# Altium schematic sheet OZ440-SE130-CAR001-SCH1.SchDoc: Carte IHM
size A3; Date: 08/07/14; CheckedBy: GS; Author: BM; DocumentNumber: OZ440-SE130-CAR001-SCH01; Revision: 2; SheetNumber: 1; SheetTotal: 1
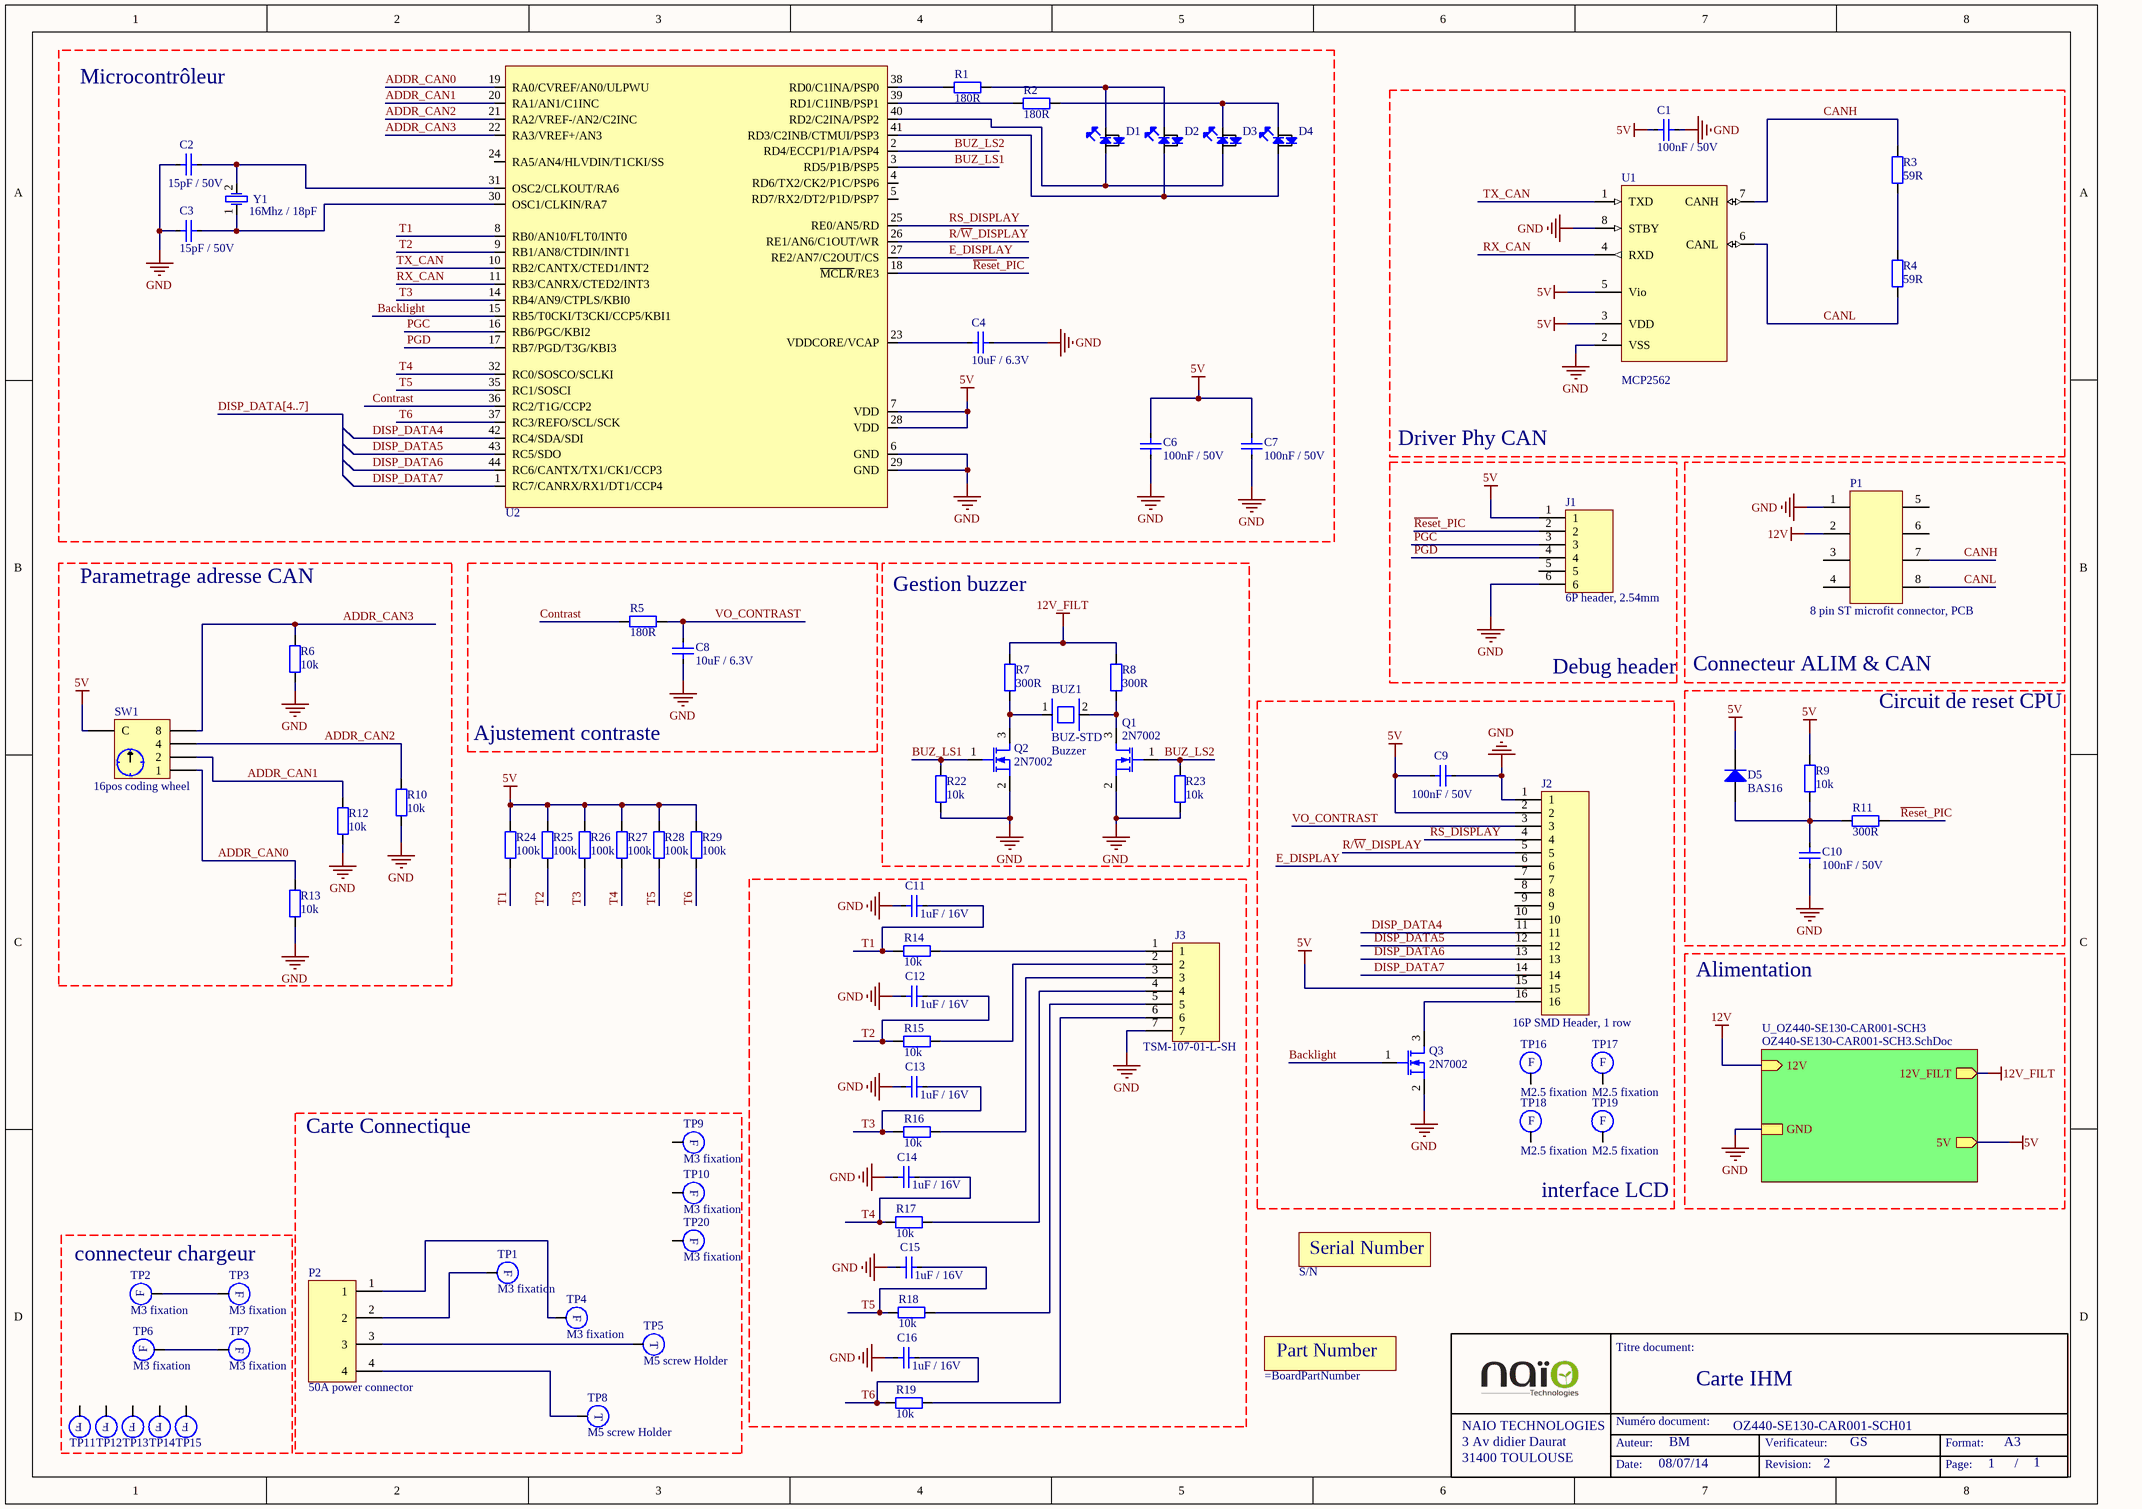
[diagram p0: OZ440-SE130-CAR001-SCH1.SchDoc]

## Parts
BUZ1  BUZ-STD  Displayed reference: Buzzer  [BUZ-SPE-SMAT24_P10]
C1  Displayed reference: 100nF / 50V  [C0805-STD]  (hidden comment: CAP-SMD)
C2  Displayed reference: 15pF / 50V  [C0805-STD]  (hidden comment: CAP-SMD)
C3  Displayed reference: 15pF / 50V  [C0805-STD]  (hidden comment: CAP-SMD)
C4  Displayed reference: 10uF / 6.3V  [C0805-STD]  (hidden comment: CAP-SMD)
C6  Displayed reference: 100nF / 50V  [C0805-STD]  (hidden comment: CAP-SMD)
C7  Displayed reference: 100nF / 50V  [C0805-STD]  (hidden comment: CAP-SMD)
C8  Displayed reference: 10uF / 6.3V  [C0805-STD]  (hidden comment: CAP-SMD)
C9  Displayed reference: 100nF / 50V  [C0805-STD]  (hidden comment: CAP-SMD)
C10  Displayed reference: 100nF / 50V  [C0805-STD]  (hidden comment: CAP-SMD)
C11  Displayed reference: 1uF / 16V  [C0805-STD]  (hidden comment: CAP-SMD)
C12  Displayed reference: 1uF / 16V  [C0805-STD]  (hidden comment: CAP-SMD)
C13  Displayed reference: 1uF / 16V  [C0805-STD]  (hidden comment: CAP-SMD)
C14  Displayed reference: 1uF / 16V  [C0805-STD]  (hidden comment: CAP-SMD)
C15  Displayed reference: 1uF / 16V  [C0805-STD]  (hidden comment: CAP-SMD)
C16  Displayed reference: 1uF / 16V  [C0805-STD]  (hidden comment: CAP-SMD)
D1  LED_BIC  [LED_3MM]  (value not drawn)  (no BOM)
D2  LED_BIC  [LED_3MM]  (value not drawn)  (no BOM)
D3  LED_BIC  [LED_3MM]  (value not drawn)  (no BOM)
D4  LED_BIC  [LED_3MM]  (value not drawn)  (no BOM)
D5  Displayed reference: BAS16  [SOT23-STD]  (hidden comment: BAS16-SOT23)
J1  Displayed reference: 6P header, 2.54mm  [6P_HEADER-STD_TH_1ROW]  (hidden comment: CONN-STD-6P_1ROW)
J2  Displayed reference: 16P SMD Header, 1 row  [16P_HEADER-SPE-TSM_116_01_L_SV]  (hidden comment: CONN-STD-16P_1ROW)
J3  Displayed reference: TSM-107-01-L-SH  [7P_HEADER-SPE-TSM_107_01_L_SH]  (hidden comment: CONN-STD-7P_1ROW)
P1  Displayed reference: 8 pin ST microfit connector, PCB  [CONN-SPE_MOLEX_43045-0812]  (hidden comment: CONN-SPE-8P_MOLEX_43045-0801)
P2  Displayed reference: 50A power connector  [CONN-SPE-428194213_MOLEX]  (hidden comment: CONN-STD-4P_puissance)
PN  PART-NUMBER  [PART_NUMBER_SMALL-STD]  (value not drawn)  (no BOM)
Q1  Displayed reference: 2N7002  [SOT23-SPE-2N7002]  (hidden comment: 2N7002-SMD3P)
Q2  Displayed reference: 2N7002  [SOT23-SPE-2N7002]  (hidden comment: 2N7002-SMD3P)
Q3  Displayed reference: 2N7002  [SOT23-SPE-2N7002]  (hidden comment: 2N7002-SMD3P)
R1  Displayed reference: 180R  [R0805-STD]  (hidden comment: RES-SMD)
R2  Displayed reference: 180R  [R0805-STD]  (hidden comment: RES-SMD)
R3  Displayed reference: 59R  [R0805-STD]  (hidden comment: RES-SMD)
R4  Displayed reference: 59R  [R0805-STD]  (hidden comment: RES-SMD)
R5  Displayed reference: 180R  [R0805-STD]  (hidden comment: RES-SMD)
R6  Displayed reference: 10k  [R0805-STD]  (hidden comment: RES-SMD)
R7  Displayed reference: 300R  [R0805-STD]  (hidden comment: RES-SMD)
R8  Displayed reference: 300R  [R0805-STD]  (hidden comment: RES-SMD)
R9  Displayed reference: 10k  [R0805-STD]  (hidden comment: RES-SMD)
R10  Displayed reference: 10k  [R0805-STD]  (hidden comment: RES-SMD)
R11  Displayed reference: 300R  [R0805-STD]  (hidden comment: RES-SMD)
R12  Displayed reference: 10k  [R0805-STD]  (hidden comment: RES-SMD)
R13  Displayed reference: 10k  [R0805-STD]  (hidden comment: RES-SMD)
R14  Displayed reference: 10k  [R0805-STD]  (hidden comment: RES-SMD)
R15  Displayed reference: 10k  [R0805-STD]  (hidden comment: RES-SMD)
R16  Displayed reference: 10k  [R0805-STD]  (hidden comment: RES-SMD)
R17  Displayed reference: 10k  [R0805-STD]  (hidden comment: RES-SMD)
R18  Displayed reference: 10k  [R0805-STD]  (hidden comment: RES-SMD)
R19  Displayed reference: 10k  [R0805-STD]  (hidden comment: RES-SMD)
R22  Displayed reference: 10k  [R0805-STD]  (hidden comment: RES-SMD)
R23  Displayed reference: 10k  [R0805-STD]  (hidden comment: RES-SMD)
R24  Displayed reference: 100k  [R0805-STD]  (hidden comment: RES-SMD)
R25  Displayed reference: 100k  [R0805-STD]  (hidden comment: RES-SMD)
R26  Displayed reference: 100k  [R0805-STD]  (hidden comment: RES-SMD)
R27  Displayed reference: 100k  [R0805-STD]  (hidden comment: RES-SMD)
R28  Displayed reference: 100k  [R0805-STD]  (hidden comment: RES-SMD)
R29  Displayed reference: 100k  [R0805-STD]  (hidden comment: RES-SMD)
SN1  Displayed reference: S/N  [SERIAL_NUMBER-STD]  (hidden comment: SERIAL-NUMBER)  (no BOM)
SW1  Displayed reference: 16pos coding wheel  [SW-SPE-CTS_220-AMA16]  (hidden comment: Switch-STD-coding_wheel)
TP1  Displayed reference: M3 fixation  [MEC-STD-FIX_M3]  (hidden comment: FIX-STD-PCB_FIXATION)
TP2  Displayed reference: M3 fixation  [MEC-STD-FIX_M3]  (hidden comment: FIX-STD-PCB_FIXATION)
TP3  Displayed reference: M3 fixation  [MEC-STD-FIX_M3]  (hidden comment: FIX-STD-PCB_FIXATION)
TP4  Displayed reference: M3 fixation  [MEC-STD-FIX_M3]  (hidden comment: FIX-STD-PCB_FIXATION)
TP5  Displayed reference: M5 screw Holder  [MEC-SPE-WURTHZ_7460408]  (hidden comment: TP-STD-TEST_POINT)
TP6  Displayed reference: M3 fixation  [MEC-STD-FIX_M3]  (hidden comment: FIX-STD-PCB_FIXATION)
TP7  Displayed reference: M3 fixation  [MEC-STD-FIX_M3]  (hidden comment: FIX-STD-PCB_FIXATION)
TP8  Displayed reference: M5 screw Holder  [MEC-SPE-WURTHZ_7460408]  (hidden comment: TP-STD-TEST_POINT)
TP9  Displayed reference: M3 fixation  [MEC-STD-FIX_M3]  (hidden comment: FIX-STD-PCB_FIXATION)
TP10  Displayed reference: M3 fixation  [MEC-STD-FIX_M3]  (hidden comment: FIX-STD-PCB_FIXATION)
TP11  FIX-STD-PCB_FIXATION  [MEC-STD-FIX_M3]  (value not drawn)
TP12  FIX-STD-PCB_FIXATION  [MEC-STD-FIX_M3]  (value not drawn)
TP13  FIX-STD-PCB_FIXATION  [MEC-STD-FIX_M3]  (value not drawn)
TP14  FIX-STD-PCB_FIXATION  [MEC-STD-FIX_M3]  (value not drawn)
TP15  FIX-STD-PCB_FIXATION  [MEC-STD-FIX_M3]  (value not drawn)
TP16  Displayed reference: M2.5 fixation  [MEC-STD-FIX_M2_5]  (hidden comment: FIX-STD-PCB_FIXATION)
TP17  Displayed reference: M2.5 fixation  [MEC-STD-FIX_M2_5]  (hidden comment: FIX-STD-PCB_FIXATION)
TP18  Displayed reference: M2.5 fixation  [MEC-STD-FIX_M2_5]  (hidden comment: FIX-STD-PCB_FIXATION)
TP19  Displayed reference: M2.5 fixation  [MEC-STD-FIX_M2_5]  (hidden comment: FIX-STD-PCB_FIXATION)
TP20  Displayed reference: M3 fixation  [MEC-STD-FIX_M3]  (hidden comment: FIX-STD-PCB_FIXATION)
U1  Displayed reference: MCP2562  [SO8-SPE-MCP2561]  (hidden comment: MCP2562-SOIC08)
U2  P18F45K80-TQFP44  [TQFP44-SPE-PIC18F45k80]  (value not drawn)
Y1  Displayed reference: 16Mhz / 18pF  [XTAL-SPE-HC49_SMD]  (hidden comment: XTAL-SMD)

## Sub-sheets
U_OZ440-SE130-CAR001-SCH3 = OZ440-SE130-CAR001-SCH3.SchDoc: 12V (in), 5V (out), GND, 12V_FILT (out)

## Nets
5V: C1.2 C6.2 C7.2 C9.2 D5.3(K) J1.1 J2.2 J2.15 R9.2 R24.2 R25.2 R26.2 R27.2 R28.2 R29.2 SW1.C U1.3(VDD) U1.5(Vio) U2.7(VDD) U2.28(VDD) ; sheet U_OZ440-SE130-CAR001-SCH3/5V
12V: P1.2 ; sheet U_OZ440-SE130-CAR001-SCH3/12V
12V_FILT: R7.2 R8.2 ; sheet U_OZ440-SE130-CAR001-SCH3/12V_FILT
GND: C1.1 C2.1 C3.1 C4.2 C6.1 C7.1 C8.1 C9.1 C10.1 C11.2 C12.2 C13.2 C14.2 C15.2 C16.2 J1.6 J2.1 J3.7 P1.1 Q1.2(S) Q2.2(S) Q3.2(S) R6.1 R10.1 R12.1 R13.1 R22.2 R23.2 U1.2(VSS) U1.8(STBY) U2.6(GND) U2.29(GND) ; sheet U_OZ440-SE130-CAR001-SCH3/GND
~{Rese}t_PIC: J1.2 R11.2 U2.18(~{MCLR}/RE3)
ADDR_CAN0: R13.2 SW1.1 U2.19(RA0/CVREF/AN0/ULPWU)
ADDR_CAN1: R12.2 SW1.2 U2.20(RA1/AN1/C1INC)
ADDR_CAN2: R10.2 SW1.4 U2.21(RA2/VREF-/AN2/C2INC)
ADDR_CAN3: R6.2 SW1.8 U2.22(RA3/VREF+/AN3)
Backlight: Q3.1(G) U2.15(RB5/T0CKI/T3CKI/CCP5/KBI1)
BUZ_LS1: Q2.1(G) R22.1 U2.3(RD5/P1B/PSP5)
BUZ_LS2: Q1.1(G) R23.1 U2.2(RD4/ECCP1/P1A/PSP4)
CANH: P1.7 R3.2 U1.7(CANH)
CANL: P1.8 R4.1 U1.6(CANL)
Contrast: R5.1 U2.36(RC2/T1G/CCP2)
DISP_DATA4: J2.11 U2.42(RC4/SDA/SDI)
DISP_DATA5: J2.12 U2.43(RC5/SDO)
DISP_DATA6: J2.13 U2.44(RC6/CANTX/TX1/CK1/CCP3)
DISP_DATA7: J2.14 U2.1(RC7/CANRX/RX1/DT1/CCP4)
E_DISPLAY: J2.6 U2.27(RE2/AN7/C2OUT/CS)
PGC: J1.3 U2.16(RB6/PGC/KBI2)
PGD: J1.4 U2.17(RB7/PGD/T3G/KBI3)
R/~{W}_DISPLAY: J2.5 U2.26(RE1/AN6/C1OUT/WR)
RS_DISPLAY: J2.4 U2.25(RE0/AN5/RD)
RX_CAN: U1.4(RXD) U2.11(RB3/CANRX/CTED2/INT3)
T1: C11.1 R14.2 R24.1 U2.8(RB0/AN10/FLT0/INT0)
T2: C12.1 R15.2 R25.1 U2.9(RB1/AN8/CTDIN/INT1)
T3: C13.1 R16.2 R26.1 U2.14(RB4/AN9/CTPLS/KBI0)
T4: C14.1 R17.2 R27.1 U2.32(RC0/SOSCO/SCLKI)
T5: C15.1 R18.2 R28.1 U2.35(RC1/SOSCI)
T6: C16.1 R19.2 R29.1 U2.37(RC3/REFO/SCL/SCK)
TX_CAN: U1.1(TXD) U2.10(RB2/CANTX/CTED1/INT2)
VO_CONTRAST: C8.2 J2.3 R5.2
NetBUZ1_1: BUZ1.1 Q2.3(D) R7.1
NetBUZ1_2: BUZ1.2 Q1.3(D) R8.1
NetC2_2: C2.2 U2.31(OSC2/CLKOUT/RA6) Y1.2(OSC2)
NetC3_2: C3.2 U2.30(OSC1/CLKIN/RA7) Y1.1(OSC1)
NetC4_1: C4.1 U2.23(VDDCORE/VCAP)
NetC10_2: C10.2 D5.1(A) R9.1 R11.1
NetD1_1: D1.1(A) D3.1(A) U2.40(RD2/C2INA/PSP2)
NetD1_2: D1.2 D2.2 R1.2
NetD2_1: D2.1(A) D4.1(A) U2.41(RD3/C2INB/CTMUI/PSP3)
NetD3_2: D3.2 D4.2 R2.2
NetJ2_16: J2.16 Q3.3(D)
NetJ3_1: J3.1 R14.1
NetJ3_2: J3.2 R15.1
NetJ3_3: J3.3 R16.1
NetJ3_4: J3.4 R17.1
NetJ3_5: J3.5 R18.1
NetJ3_6: J3.6 R19.1
NetP2_1: P2.1 TP4.1(T)
NetP2_2: P2.2 TP1.1(T)
NetP2_3: P2.3 TP5.1(T)
NetP2_4: P2.4 TP8.1(T)
NetR1_1: R1.1 U2.38(RD0/C1INA/PSP0)
NetR2_1: R2.1 U2.39(RD1/C1INB/PSP1)
NetR3_1: R3.1 R4.2
NetTP2_1: TP2.1(T) TP3.1(T)
NetTP6_1: TP6.1(T) TP7.1(T)

Not connected (* = marked no-connect by the designer): J1 5; J2 7 8 9 10; P1 3 4(7) 5(9) 6; TP9 1(T); TP10 1(T); TP11 1(T); TP12 1(T); TP13 1(T); TP14 1(T); TP15 1(T); TP16 1(T); TP17 1(T); TP18 1(T); TP19 1(T); TP20 1(T); U2 4(RD6/TX2/CK2/P1C/PSP6) 5(RD7/RX2/DT2/P1D/PSP7) 24(RA5/AN4/HLVDIN/T1CKI/SS)

## Buses and harness runs
bus DISP_DATA[4..7]

## Notes on the sheet
- Microcontrôleur
- Driver Phy CAN
- Parametrage adresse CAN
- Gestion buzzer
- Debug header
- Connecteur ALIM & CAN
- Circuit de reset CPU
- Ajustement contraste
- Alimentation
- Carte Connectique
- connecteur chargeur
- interface LCD
- Titre document:
- NAIO TECHNOLOGIES
- 3 Av didier Daurat
- 31400 TOULOUSE
- Auteur:
- Numéro document:
- Verificateur:
- Format:
- A3
- Date:
- Revision:
- Page:
- /
- (in symbol M2.5 Fixation) F
- (in symbol M3 Fixation) F
- (in symbol Small part number) Part Number

## Library data of the parts
BUZ1 = SMAT24P10: 90db Piezzo transducer; Manufacturer: SONITRON; Max Voltage: 30Vpp; Validated: False; Reference: SMAT24P10; Pin Count: 2; Rev: 2014; helpURL: http://sonitron.ceros.com/sonitroncatalogue/edition2014/page/42
C1 C6 C7 C9 C10 = VJ0805Y104KXAxx: 0805 100nF / 50V  X7R ceramic capacitor; Manufacturer: vishay; Max Voltage: 50; Tolerance: +/- 10%; Validated: N; Reference: VJ0805Y104KXAxx; Value: 100nF; Material: X7R; Footprint description: standard Capacitor 0805; Pin Count: 2; helpURL: http://www.vishay.com/docs/45200/highrels.pdf; Supplier 1: Farnell; Supplier Part Number 1: 1612208; Supplier 2: Digi-Key; Supplier Part Number 2: 720-1266-6-ND
C2 C3 = C0805C150J5GACxx: 0805 15pF / 50V COG ceramic capacitor; Manufacturer: Kemet; Max Voltage: 50; Tolerance: +/- 5%; Validated: N; Reference: C0805C150J5GACxx; Value: 15pF; Material: COG; Footprint description: standard Capacitor 0805; Pin Count: 2; helpURL: http://www.farnell.com/datasheets/40863.pdf; Supplier 1: Farnell; Supplier Part Number 1: 1650868; Supplier 2: Digi-Key; Supplier Part Number 2: 399-1111-1-ND
C4 C8 = C0805C106K9PACxx: 0805 10uF / 6.3V X5R ceramic capacitor; Manufacturer: Kemet; Max Voltage: 6.3; Tolerance: +/- 10%; Validated: N; Reference: C0805C106K9PACxx; Value: 10uF; Material: X5R; Footprint description: standard Capacitor 0805; Pin Count: 2; helpURL: http://www.farnell.com/datasheets/40863.pdf; Supplier 1: Farnell; Supplier Part Number 1: 1643357; Supplier 2: Digi-Key; Supplier Part Number 2: 399-3138-1-ND
C11-C16 = C0805C105K4RACxx: 0805 1uF / 16V X7R ceramic capacitor; Manufacturer: Kemet; Max Voltage: 16; Tolerance: +/- 10%; Validated: N; Reference: C0805C105K4RACxx; Value: 1uF; Material: X7R; Footprint description: standard Capacitor 0805; Pin Count: 2; helpURL: http://www.farnell.com/datasheets/40863.pdf; Supplier 1: Farnell; Supplier Part Number 1: 9227792; Supplier 2: Digi-Key; Supplier Part Number 2: 399-6930-1-ND
D1-D4 = MCL036PURGW: 3mm bicolor LED; Manufacturer: MULTICOMP; Displayed reference: R/G LED; Max Current: 20mA; Validated: False; Reference: MCL036PURGW; Footprint description: TH 2.54mm pitch; Pin Count: 2; Rev: A; helpURL: http://www.farnell.com/datasheets/482361.pdf
D5 = BAS16: 100V / 120mA signal  diode; Manufacturer: NXP; Max Voltage: 100; Max Current: 0.2A; Validated: False; Reference: BAS16; component type: DIODE; Footprint description: Sot23 SMD package; Pin Count: 3; Rev: 2010; helpURL: http://www.nxp.com/documents/data_sheet/BAS16_SER.pdf; Supplier 1: Farnell; Supplier Part Number 1: 1081180; Supplier 2: Digi-Key; Supplier Part Number 2: 568-1596-1-ND
J1 = 68000-406HLF: 6P, 1 row, 2.54mm header; Manufacturer: FCI; Validated: False; Reference: 68000-406HLF; Footprint description: TH, 6 pin, 2.54mm; Pin Count: 6; Rev: DB; helpURL: http://portal.fciconnect.com/Comergent//fci/drawing/68000.pdf
J2 = TSM-116-01-L-SV: 16 pin, 2.54mm pitch header, SM; Manufacturer: SAMTEC; Validated: False; Reference: TSM-116-01-L-SV; Footprint description: SMD 16 pin, 1 row, 2.54mm pitch; Pin Count: 16; Rev: 28/05/14; helpURL: http://cloud.samtec.com/catalog_english/TSM.PDF; Supplier 1: Farnell; Supplier Part Number 1: 1804334
J3 = TSM-107-01-L-SH: 7 pin horizontal Header SMD; Manufacturer: SAMTEC; Validated: False; Reference: TSM-107-01-L-SH; Footprint description: 7 pin header, RA, SMD; Pin Count: 7; Rev: 28-05-2014; helpURL: http://www.samtec.com/documents/webfiles/pdf/tsm.pdf; Supplier 1: Farnell; Supplier Part Number 1: 1803615
P1 = 43045-0812: 8 pin Microfit connector; Manufacturer: Molex; Max Voltage: 600V; Max Current: 5A; Reference: 43045-0812; Footprint description: 8 pin SMT connector ST, TH; Rev: G; helpURL: http://www.molex.com/pdm_docs/sd/430450812_sd.pdf
P2 = 42819-4213: 4 pin power connector; Manufacturer: Molex; Max Voltage: 600V; Max Current: 50A; Validated: False; Reference: 42819-4213; Footprint description: Thu hole 10mm pitch; Pin Count: 4; Rev: E6; helpURL: http://www.molex.com/pdm_docs/sd/428194213_sd.pdf; Supplier 1: Mouser; Supplier Part Number 1: 538-42819-4213; Supplier 2: Newark; Supplier Part Number 2: 92M0969
PN = Small part number: small part number copper identification; Validated: False; Reference: Small part number; Displayed reference: =BoardPartNumber
Q1-Q3 = 2N7002: N-Channel Enhancement Mode Field Effect Transistor; Manufacturer: FAIRCHILD; Max Voltage: 60 V; Max Current: 0,4 A; Rated Power: 0,2 W; Validated: False; Reference: 2N7002; component type: NMOS; Footprint description: SOT23; Pin Count: 3; Rev: A1; helpURL: http://www.fairchildsemi.com/ds/2N/2N7000.pdf; Supplier 1: Farnell; Supplier Part Number 1: 9845313; Supplier 2: Newark; Supplier Part Number 2: 58K9651
R1 R2 R5 = CRCW0805180RFKxx: 180 Ohm 0805 SMD resistor; Manufacturer: Vishay; Value: 180; Tolerance: 1 %; Rated Power: 0,125 W; Validated: No; Reference: CRCW0805180RFKxx; Footprint description: standard 0805 SMD; Pin Count: 2; helpURL: http://www.vishay.com/docs/20035/dcrcwe3.pdf; Supplier 1: Farnell; Supplier Part Number 1: 1652931; Supplier 2: Mouser; Supplier Part Number 2: 71-CRCW0805-180
R3 R4 = CRCW080559R0FKxx: 59 Ohm 0805 SMD resistor; Manufacturer: Vishay; Value: 59; Tolerance: 1 %; Rated Power: 0.125 W; Validated: No; Reference: CRCW080559R0FKxx; Footprint description: standard 0805 SMD; Pin Count: 2; helpURL: http://www.vishay.com/docs/20035/dcrcwe3.pdf; Supplier 1: Mouser; Supplier Part Number 1: 71-CRCW080559R0FKEA; Supplier 2: Farnell; Supplier Part Number 2: 2138817
R6 R9 R10 R12-R19 R22 R23 = CRCW080510K0FKxx: 10k Ohm 0805 SMD resistor; Manufacturer: Vishay; Value: 10 000; Tolerance: 1 %; Rated Power: 0,125 W; Validated: No; Reference: CRCW080510K0FKxx; Footprint description: standard 0805 SMD; Pin Count: 2; helpURL: http://www.vishay.com/docs/20035/dcrcwe3.pdf; Supplier 1: Farnell; Supplier Part Number 1: 1469856; Supplier 2: Mouser; Supplier Part Number 2: 71-CRCW0805-10K-E3
R7 R8 R11 = CRCW0805300RFKxx: 300 ohm 0805 SMD resistor; Manufacturer: Vishay; Value: 300; Tolerance: 1%; Rated Power: 0.125W; Validated: No; Reference: CRCW0805300RFKxx; Footprint description: standard 0805 SMD; Pin Count: 2; helpURL: http://www.vishay.com/docs/20035/dcrcwe3.pdf; Supplier 1: Mouser; Supplier Part Number 1: 71-CRCW0805300RFKEA; Supplier 2: Farnell; Supplier Part Number 2: 1152346
R24-R29 = CRCW0805100KFKxx: 100k Ohm 0805 SMD resistor; Manufacturer: Vishay; Value: 100 000; Tolerance: 1 %; Rated Power: 0,125 W; Validated: No; Reference: CRCW0805100KFKxx; Footprint description: standard 0805 SMD; Pin Count: 2; helpURL: http://www.vishay.com/docs/20035/dcrcwe3.pdf; Supplier 1: Farnell; Supplier Part Number 1: 1469860; Supplier 2: Mouser; Supplier Part Number 2: 71-CRCW0805-100K-E3
SN1 = Serial Number: serial number copper identification; Validated: False; Reference: Serial Number
SW1 = 220AMA16x: 16 positions rotary dip switch; Manufacturer: CTS; Validated: False; Reference: 220AMA16x; Footprint description: 10x10mm SMD; Pin Count: 6; Rev: 20/02/14; helpURL: http://www.ctscorp.com/components/Datasheets/220.pdf; Supplier 1: Mouser; Supplier Part Number 1: 774-220AMA16R; Supplier 2: Digi-Key; Supplier Part Number 2: CT3072-6-ND
TP1-TP4 TP6 TP7 TP9-TP15 TP20 = M3 Fixation: M3 Hole for Board fixation; Validated: False; Reference: M3 Fixation
  TP11-TP15: Displayed reference: M3 fixation
TP5 TP8 = 7460408: Bush with threaded hole M5; Manufacturer: WURTHZ; Max Current: 160A; Validated: False; Reference: 7460408; Material: CuZn39Pb3; Footprint description: Pressfit Bush with threaded hole M5; Pin Count: 1; helpURL: http://katalog.we-online.de/em/datasheet/7460408.pdf; Supplier 1: Farnell; Supplier Part Number 1: 1821279; Supplier 2: Mouser; Supplier Part Number 2: 710-7460408
TP16-TP19 = M2.5 Fixation: M2.5 Hole for Board fixation; Validated: False; Reference: M2.5 Fixation
U1 = MCP2562-E/SN: CAN transceiver with Vio pin; Manufacturer: Microchip; Max Voltage: 5.5V; Validated: False; Reference: MCP2562-E/SN; Footprint description: standard SO8; Pin Count: 8; Rev: B; helpURL: http://ww1.microchip.com/downloads/en/DeviceDoc/25167B.pdf; Supplier 1: Farnell; Supplier Part Number 1: 2362839; Supplier 2: Mouser; Supplier Part Number 2: 579-MCP2562-E/SN
U2 = PIC18F45K80-I/PT: Pic microcontroller with embeded CAN controller; Manufacturer: MICROCHIP; Validated: False; Reference: PIC18F45K80-I/PT; Displayed reference: PIC18F45K80-I/PT; Footprint description: standard TQFP 44 pin; Pin Count: 44; Rev: F; helpURL: http://ww1.microchip.com/downloads/en/DeviceDoc/39977f.pdf; Supplier 1: Farnell; Supplier Part Number 1: 1823169; Supplier 2: Mouser; Supplier Part Number 2: 579-PIC18F45K80-I/PT
Y1 = MCRSD16000F183000RR: 16Mhz Crystal; Manufacturer: Multicomp; Value: 16 000; Validated: False; Reference: MCRSD16000F183000RR; Footprint description: HC49 /US SMD; Pin Count: 2; Frequency band: 16Mhz; Rev: 1.0; helpURL: http://www.farnell.com/datasheets/1801275.pdf; Supplier 1: Farnell; Supplier Part Number 1: 2395958